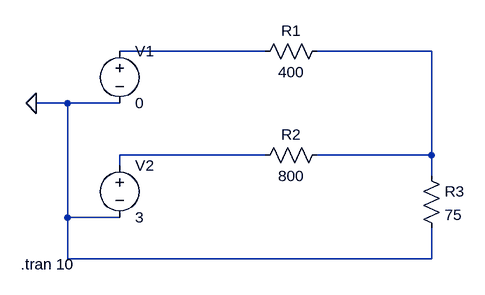
[diagram p0: schematic Draft1.asc]
Draft1.asc, the LTspice schematic file:
Version 4
SHEET 1 880 680
WIRE 288 64 64 64
WIRE 544 64 368 64
WIRE -16 144 -64 144
WIRE 64 144 -16 144
WIRE 288 224 64 224
WIRE 544 224 544 64
WIRE 544 224 368 224
WIRE 64 240 64 224
WIRE 544 256 544 224
WIRE -16 320 -16 144
WIRE 64 320 -16 320
WIRE -16 384 -16 320
WIRE 544 384 544 336
WIRE 544 384 -16 384
FLAG -64 144 0
SYMBOL voltage 64 48 R0
WINDOW 123 0 0 Left 2
WINDOW 39 0 0 Left 2
SYMATTR InstName V1
SYMATTR Value 0
SYMBOL voltage 64 224 R0
WINDOW 123 0 0 Left 2
WINDOW 39 0 0 Left 2
SYMATTR InstName V2
SYMATTR Value 3
SYMBOL res 272 80 R270
WINDOW 0 32 56 VTop 2
WINDOW 3 0 56 VBottom 2
SYMATTR InstName R1
SYMATTR Value 400
SYMBOL res 272 240 R270
WINDOW 0 32 56 VTop 2
WINDOW 3 0 56 VBottom 2
SYMATTR InstName R2
SYMATTR Value 800
SYMBOL res 528 240 R0
SYMATTR InstName R3
SYMATTR Value 75
TEXT -88 392 Left 2 !.tran 10

The netlist it stands for:
* Draft1.asc
V1 N001 0 0
V2 N003 0 3
R1 N001 N002 400
R2 N003 N002 800
R3 N002 0 75
.tran 10
.backanno
.end